# Altium schematic sheet mcu.SchDoc
size A4; SheetNumber: 2; SheetTotal: 3
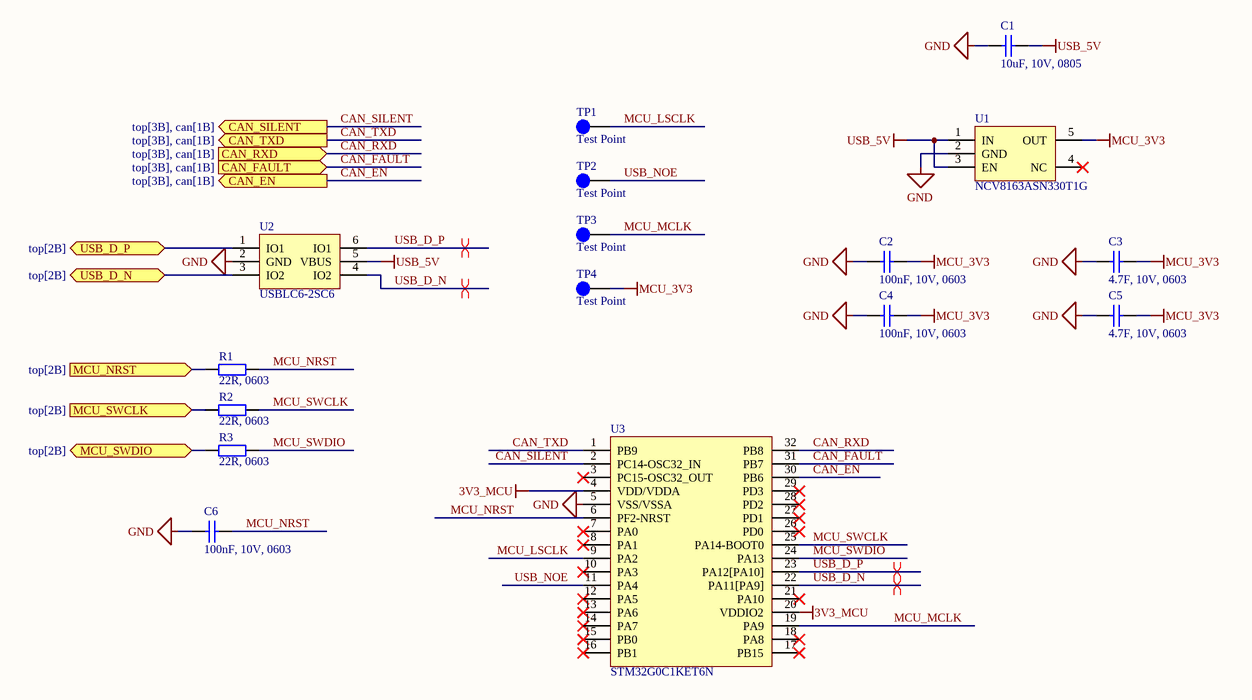
[diagram p0: mcu.SchDoc]

## Parts
C1  10uF, 10V, 0805  [GENERIC_MLCC_CAP_0805_IPC_MEDIUM_DENSITY]
C2  100nF, 10V, 0603  [GENERIC_MLCC_CAP_0603_IPC_MEDIUM_DENSITY]
C3  4.7F, 10V, 0603  [GENERIC_MLCC_CAP_0603_IPC_MEDIUM_DENSITY]
C4  100nF, 10V, 0603  [GENERIC_MLCC_CAP_0603_IPC_MEDIUM_DENSITY]
C5  4.7F, 10V, 0603  [GENERIC_MLCC_CAP_0603_IPC_MEDIUM_DENSITY]
C6  100nF, 10V, 0603  [GENERIC_MLCC_CAP_0603_IPC_MEDIUM_DENSITY]
R1  22R, 0603  [GENERIC_CHIP_RES_0603_IPC_MEDIUM_DENSITY]
R2  22R, 0603  [GENERIC_CHIP_RES_0603_IPC_MEDIUM_DENSITY]
R3  22R, 0603  [GENERIC_CHIP_RES_0603_IPC_MEDIUM_DENSITY]
TP1  Test Point  [TEST_POINT_CIRCLE_1MM]  (no BOM)
TP2  Test Point  [TEST_POINT_CIRCLE_1MM]  (no BOM)
TP3  Test Point  [TEST_POINT_CIRCLE_1MM]  (no BOM)
TP4  Test Point  [TEST_POINT_CIRCLE_1MM]  (no BOM)
U1  NCV8163ASN330T1G  [NCV8163ASN330T1G_TSOP5]
U2  USBLC6-2SC6  [USBLC6-2SC6-SOT23-6L]
U3  STM32G0C1KET6N  [STM32G0C1KET6N_LQFP32]

## Ports
CAN_EN (out, see top[3B], can[1B]), CAN_FAULT (in, see top[3B], can[1B]), CAN_RXD (in, see top[3B], can[1B]), CAN_SILENT (out, see top[3B], can[1B]), CAN_TXD (out, see top[3B], can[1B]), MCU_NRST (in, see top[2B]), MCU_SWCLK (in, see top[2B]), MCU_SWDIO (bidir, see top[2B]), USB_D_N (bidir, see top[2B]), USB_D_P (bidir, see top[2B])

## Nets
3V3_MCU: U3.4(VDD/VDDA) U3.20(VDDIO2)
GND: C1.1 C2.1 C3.1 C4.1 C5.1 C6.1 U1.2(GND) U2.2(GND) U3.5(VSS/VSSA)
MCU_3V3: C2.2 C3.2 C4.2 C5.2 TP4.1(TP) U1.5(OUT)
USB_5V: C1.2 U1.1(IN) U1.3(EN) U2.5(VBUS)
CAN_EN: U3.30(PB6) ; port CAN_EN
CAN_FAULT: U3.31(PB7) ; port CAN_FAULT
CAN_RXD: U3.32(PB8) ; port CAN_RXD
CAN_SILENT: U3.2(PC14-OSC32_IN) ; port CAN_SILENT
CAN_TXD: U3.1(PB9) ; port CAN_TXD
MCU_LSCLK: TP1.1(TP) U3.9(PA2)
MCU_MCLK: TP3.1(TP) U3.19(PA9)
MCU_NRST: C6.2 R1.2 U3.6(PF2-NRST)
MCU_NRST: R1.1 ; port MCU_NRST  [a separate net that carries the same name]
MCU_SWCLK: R2.2 U3.25(PA14-BOOT0)
MCU_SWCLK: R2.1 ; port MCU_SWCLK  [a separate net that carries the same name]
MCU_SWDIO: R3.2 U3.24(PA13)
MCU_SWDIO: R3.1 ; port MCU_SWDIO  [a separate net that carries the same name]
USB_D_N: U2.4(IO2) U3.22(PA11[PA9])
USB_D_N: U2.3(IO2) ; port USB_D_N  [a separate net that carries the same name]
USB_D_P: U2.6(IO1) U3.23(PA12[PA10])
USB_D_P: U2.1(IO1) ; port USB_D_P  [a separate net that carries the same name]
USB_NOE: TP2.1(TP) U3.11(PA4)

Not connected (* = marked no-connect by the designer): U1 4(NC)*; U3 3(PC15-OSC32_OUT)* 7(PA0)* 8(PA1)* 10(PA3)* 12(PA5)* 13(PA6)* 14(PA7)* 15(PB0)* 16(PB1)* 17(PB15)* 18(PA8)* 21(PA10)* 26(PD0)* 27(PD1)* 28(PD2)* 29(PD3)*

## Layout directives
differential pair: USB_D_N, USB_D_P

## Library data of the parts
C1-C6 = Generic Non-polarised Capacitor: Part Number: *; Manufacturer: *
  C1: Value: 10uF, 10V, 0805
  C2 C4 C6: Value: 100nF, 10V, 0603
  C3 C5: Value: 4.7F, 10V, 0603
R1-R3 = Generic Resistor: Value: 22R, 0603; Part Number: *; Manufacturer: *
TP1-TP4 = Test Point: generic test point; Value: 1mm; Part Number: Test Point
U1 = NCV8163ASN330T1G: 3V3 250 mA LDO; Manufacturer: Onsemi; Value: 3V3, 250mA; Part Number: NCV8163ASN330T1G
U2 = USBLC6-2SC6: Very low capacitance ESD protection for the USB bus.; Manufacturer: ST; Value: USBLC6-2SC6; Part Number: USBLC6-2SC6
U3 = STM32G0C1KET6N: STM32G0, Arm® Cortex®-M0+ 32-bit MCU, 512KB Flash, 144KB RAM, LQFP32; Manufacturer: ST; Value: STM32G0C1KET6N; Part Number: STM32G0C1KET6N